# EasyEDA Pro project ProPrj_嵌赛国赛_2025-08-15.epro, schematic Schematic5
Board Name: 4G模块分线板; Create Date: 2025-06-17; Page Name: P1; Project Name: 嵌入式大赛; Schematic Name: Schematic5; Update Date: 2025-06-19; Company: 嘉立创EDA; Page Size: A4; Version: V1.0
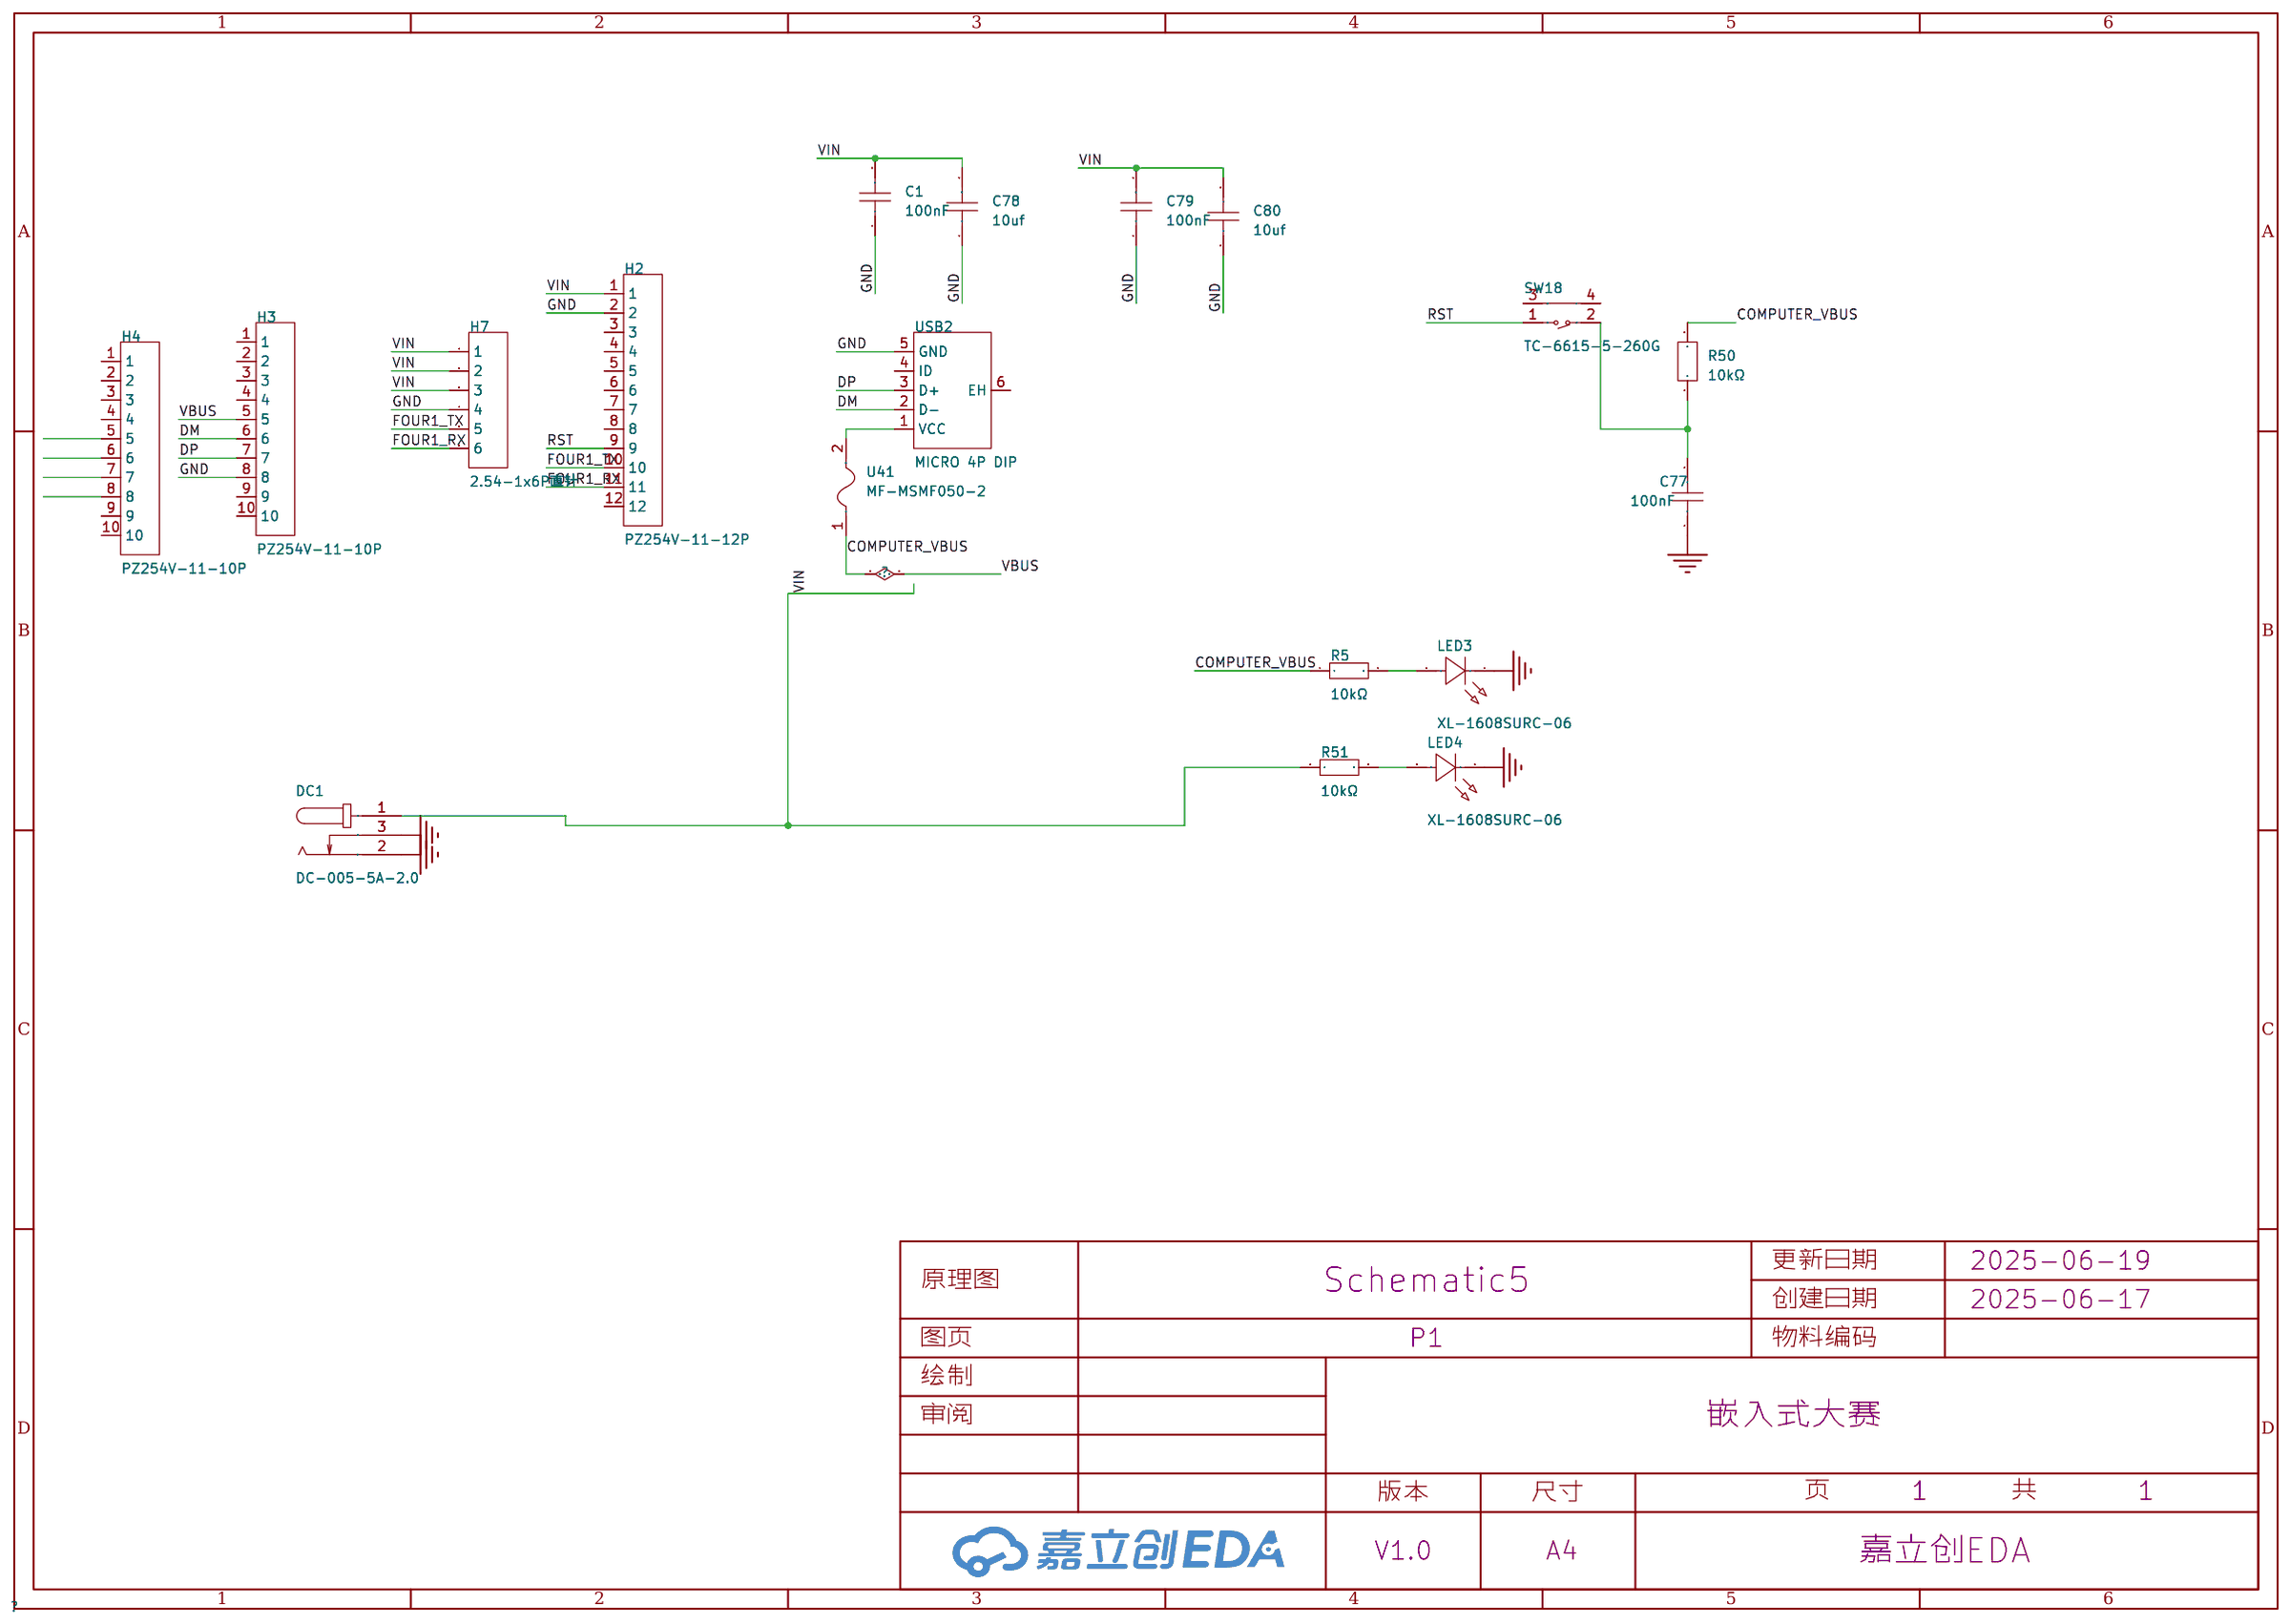
[diagram p5: schematic sheet]

## Parts
C1  100nF  [C0603]
C77  100nF  [C0603]
C78  10uf  [C0603]
C79  100nF  [C0603]
C80  10uf  [C0603]
DC1  DC-005-5A-2.0  [DC-IN-TH_DC-005-5A-2.0]
H2  PZ254V-11-12P  [HDR-TH_12P-P2.54-V-M]
H3  PZ254V-11-10P  [HDR-TH_10P-P2.54-V-M]
H4  PZ254V-11-10P  [HDR-TH_10P-P2.54-V-M]
H7  2.54-1x6P直针  [HDR-TH_6P-P2.54-V-M-1]
LED3  XL-1608SURC-06  [LED0603-RD_RED]
LED4  XL-1608SURC-06  [LED0603-RD_RED]
R5  10kΩ  [R0603]
R50  10kΩ  [R0603]
R51  10kΩ  [R0603]
SW18  TC-6615-5-260G  [SW-TH_4P-L7.5-W5.0-P4.50]
U41  MF-MSMF050-2  [F1812]
USB2  MICRO 4P DIP  [MINI-USB-SMD_MICRO-4P-DIP]

## Library data of the parts
C1 C78-C80 = CGA0603X7R104K500JT: 容值:100nF;精度:±10%;额定电压:50V;材质(温度系数):X7R;; LCSC Part Name: 100nF ±10% 50V; Supplier Part: C6119867; Manufacturer: HRE(芯声); Supplier Footprint: 0603; JLCPCB Part Class: 扩展库; Supplier: LCSC; Tolerance: ±10%; Voltage Rated: 50V; Temperature Coefficient: X7R
C77 = CC0603KRX7R9BB104: 容值:100nF;精度:±10%;额定电压:50V;材质(温度系数):X7R;; LCSC Part Name: 100nF ±10% 50V; Supplier Part: C14663; Manufacturer: YAGEO(国巨); Supplier Footprint: 0603; JLCPCB Part Class: Basic Part; Datasheet: https://atta.szlcsc.com/upload/public/pdf/source/20180910/C282072_33301C7F631E79921B82A8DAC6BCC5B3.pdf; Supplier: LCSC; Tolerance: ±10%; Voltage Rated: 50V; Temperature Coefficient: X7R
DC1 = DC-005-5A-2.0: 连接器类型:DC电源插座;安装方式:弯插;触点内径:2mm;触点外径:6.2mm;额定电流:5A;额定电压:24V;工作温度范围:-20℃~+70℃;; LCSC Part Name: DC电源插座 内径:2mm 外径:6.2mm; Supplier Part: C381116; Manufacturer: XKB Connection(中国星坤); Supplier Footprint: 插件; JLCPCB Part Class: 扩展库; Datasheet: https://atta.szlcsc.com/upload/public/pdf/source/20211015/707A35F7AB6E89C57AAB641950105BB7.pdf; Supplier: LCSC; Connector Type: DC电源插座; Mounting Style: 弯插; Inside Contact Diameter: 2mm; Outside Contact Diameter: 6.2mm; Current Rating (Max): 5A; Voltage Rating (Max): 24V; Operating Temperature Range: -20℃~+70℃
H2 = PZ254V-11-12P: 插针结构:1x12P;间距:2.54mm;行距:-;圆针/方针:方针;安装方式:直插;排数:单排;总PIN位数:12P;额定电流:3A;额定电压:250V;配合针长度:6mm;塑高:2.5mm;端接针长度:3mm;触头材质:-;工作温度:-40℃~+105℃;颜色:黑色;; LCSC Part Name: 1x12P 间距:2.54mm 方针 直插; Supplier Part: C2840012; Manufacturer: XFCN(兴飞); Supplier Footprint: 插件,P=2.54mm; JLCPCB Part Class: 扩展库; Datasheet: https://atta.szlcsc.com/upload/public/pdf/source/20200309/C492403_F9F19131791D08044AD4F84F8E751A34.pdf; Supplier: LCSC; Pin Structure: 1x12P; Pitch: 2.54mm; Circluar Pins/Square Pins: 方针; Mounting Type: 直插; Number of Rows: 单排; Number of Pins: 12P; Current Rating: 3A; Voltage Rating (Max): 250V; Length of Mating Pin: 6mm; Insulation Height: 2.5mm; Length of End Connection Pin: 3mm; Operating Temperature: -40℃~+105℃; Color: 黑色
H3 H4 = PZ254V-11-10P: 插针结构:1x10P;间距:2.54mm;行距:-;圆针/方针:方针;安装方式:直插;排数:单排;总PIN位数:10P;额定电流:-;额定电压:-;配合针长度:6mm;塑高:2.5mm;端接针长度:3mm;触头材质:黄铜;触头镀层:-;工作温度:-40℃~+105℃;颜色:黑色;; LCSC Part Name: 1x10P 间距:2.54mm 方针 直插; Supplier Part: C492409; Manufacturer: XFCN(兴飞); Supplier Footprint: 插件,P=2.54mm; JLCPCB Part Class: 扩展库; Datasheet: https://atta.szlcsc.com/upload/public/pdf/source/20200309/C492409_129C9431BDD62EBBBD0A643B6AAB9FBD.pdf; Supplier: LCSC; Pin Structure: 1x10P; Pitch: 2.54mm; Circluar Pins/Square Pins: 方针; Mounting Type: 直插; Number of Rows: 单排; Number of Pins: 10P; Length of Mating Pin: 6mm; Insulation Height: 2.5mm; Length of End Connection Pin: 3mm; Contact Material: 黄铜; Operating Temperature: -40℃~+105℃; Color: 黑色
H7 = 2.54-1x6P直针: 插针结构:1x6P;间距:2.54mm;行距:-;圆针/方针:方针;安装方式:直插;排数:单排;总PIN位数:6P;额定电流:3A;额定电压:-;配合针长度:-;塑高:-;触头材质:黄铜;触头镀层:-;工作温度:-40℃~+105℃;颜色:黑色;; LCSC Part Name: 1x6P 间距:2.54mm 方针 直插; Supplier Part: C37208; Manufacturer: BOOMELE(博穆精密); Supplier Footprint: 插件,P=2.54mm; JLCPCB Part Class: 扩展库; Datasheet: https://atta.szlcsc.com/upload/public/pdf/source/20250115/42A019761A40C8B839643401D8CA5A96.pdf; Supplier: LCSC; Pin Structure: 1x6P; Pitch: 2.54mm; Circluar Pins/Square Pins: 方针; Mounting Type: 直插; Number of Rows: 单排; Number of Pins: 6P; Current Rating: 3A; Contact Material: 黄铜; Operating Temperature: -40℃~+105℃; Color: 黑色
LED3 LED4 = XL-1608SURC-06: 发光颜色:红色;功率:55mW;正向电流:25mA;主波长:617nm~621nm;透镜颜色:无色透明透镜;色温:-;发光角度:120°;载带方式:正贴;工作温度:-30℃~+85℃;; Supplier Part: C965799; Manufacturer: XINGLIGHT(成兴光); Supplier Footprint: 0603; JLCPCB Part Class: 扩展库; Datasheet: https://atta.szlcsc.com/upload/public/pdf/source/20221102/D860AFDD1CDB02C5A8064103A32707E2.pdf; Supplier: LCSC; Emitted Color: 红色; Power Dissipation: 55mW; Forward Current: 25mA; Dominant Wavelength: 617nm~621nm; Peak Wavelength: 623nm; Lens Color: 无色透明透镜; Viewing Angle: 120°; Mounting Sytle: 正贴; Operating Temperature: -30℃~+85℃
R5 R51 = 0603WAF1002T5E: 电阻类型:厚膜电阻;阻值:10kΩ;精度:±1%;功率:100mW;最大工作电压:75V;温度系数:±100ppm/℃;; LCSC Part Name: 厚膜电阻 10kΩ ±1% 100mW; Supplier Part: C25804; Manufacturer: UNI-ROYAL(厚声); Supplier Footprint: 0603; JLCPCB Part Class: Basic Part; Datasheet: https://atta.szlcsc.com/upload/public/pdf/source/20200306/C422600_1E6D84923E4A46A82E41ADD87F860B5C.pdf; Supplier: LCSC; Type: 厚膜电阻; Tolerance: ±1%; Power(Watts): 100mW; Overload Voltage (Max): 75V; Temperature Coefficient: ±100ppm/℃; Operating Temperature Range: -55℃~+155℃
R50 = FRC0603J103TS: 电阻类型:厚膜电阻;阻值:10kΩ;精度:±5%;功率:100mW;最大工作电压:75V;温度系数:±100ppm/℃;; LCSC Part Name: 10kΩ ±5% 100mW 厚膜电阻; Supplier Part: C2930027; Manufacturer: FOJAN(富捷); Supplier Footprint: 0603; JLCPCB Part Class: 扩展库; Datasheet: https://atta.szlcsc.com/upload/public/pdf/source/20211221/925EC7D7225764EE0046F22065062C87.pdf; Supplier: LCSC; Type: 厚膜电阻; Tolerance: ±5%; Power(Watts): 100mW; Overload Voltage (Max): 75V; Temperature Coefficient: ±100ppm/℃; Operating Temperature Range: -55℃~+155℃
SW18 = TC-6615-5-260G: 电路结构:单刀单掷;按钮形状:-;作用力:260gf;安装方式:卧插;开关长度:6mm;开关宽度:6mm;开关高度:5mm;带支架:带支架;触点电流:50mA;额定电压(AC):-;额定电压(DC):12V;额定功率:-;绝缘电阻:-;带灯:-;机械寿命:-;; LCSC Part Name: 轻触6*6*5支架 插件260g; Supplier Part: C2845270; Manufacturer: HCTL(华灿天禄); Supplier Footprint: 插件; JLCPCB Part Class: 扩展库; Datasheet: https://atta.szlcsc.com/upload/public/pdf/source/20230523/3B07ECEFF69432C539FEAF1B55455C52.pdf; Supplier: LCSC; Circuit: 单刀单掷; Operating Force: 260gf; Mounting Style: 卧插; Switch Length: 6mm; Switch Width: 6mm; Switch Height: 5mm; Strike Gundam: 带支架; Contact Current: 50mA; Voltage Rating (DC): 12V
U41 = MF-MSMF050-2: 耐压:15V;最大电流:100A;保持电流(Ih):500mA;跳闸电流:1A;; LCSC Part Name: 15V 500mA 1812自恢复; Supplier Part: C17313; Manufacturer: BOURNS; Supplier Footprint: 1812; JLCPCB Part Class: 扩展库; Datasheet: https://atta.szlcsc.com/upload/public/pdf/source/20161125/1480068354310.pdf; Supplier: LCSC; Voltage - Max: 15V; Current - Max: 100A; Hold Current: 500mA; Trip Current: 1A; Resistance - Initial (Ri) (Min): 150mΩ; Resistance - Post Trip (R1) (Max): 1Ω; Time to Trip(Max): 150ms; Operating Temperature: -40℃~+85℃
USB2 = MICRO 4P DIP: 连接器类型:Micro-B;标准:USB 2.0;公母:母;安装方式:卧贴;触点数量:5P;端口数量:1;额定电流 - 电源:1A;工作温度范围:-30℃~+80℃;; LCSC Part Name: Micro-B 母 卧贴; Supplier Part: C456008; Manufacturer: SHOU HAN(首韩); Supplier Footprint: SMD; JLCPCB Part Class: Extended Part; Datasheet: https://atta.szlcsc.com/upload/public/pdf/source/20191113/C456008_715AB785ACAEB21AD2CB341B96491593.pdf; Supplier: LCSC; Connector Type: Micro-B; Standard: USB 2.0; Gender: 母; Mounting Style: 卧贴; Number of Contacts: 5P; Number of Ports: 1; Current Rating - Power (Max): 1A; Operating Temperature Range: -30℃~+80℃; Core Colour: 黑色

## Nets
GND: C1.1 C77.1 C78.1 C79.1 C80.1 DC1.2 DC1.3 H2.2 H3.8 H7.4 LED3.1(K) LED4.1(K) USB2.5(GND)
VIN: C1.2 C78.2 C79.2 C80.2 DC1.1 H2.1 H7.1 H7.2 H7.3 R51.1
COMPUTER_VBUS: H3.5 R5.1 R50.2 U41.1
DM: H3.6 USB2.2(D-)
DP: H3.7 USB2.3(D+)
FOUR1_RX: H2.11 H7.6
FOUR1_TX: H2.10 H7.5
RST: H2.9 SW18.1
$1N802: U41.2 USB2.1(VCC)
$1N1239: C77.2 R50.1 SW18.2
$1N2955: LED3.2(A) R5.2
$1N3053: LED4.2(A) R51.2

Not connected (* = marked no-connect by the designer): H2 3 4 5 6 7 8 12; H3 1 2 3 4 9 10; H4 1 2 3 4 5 6 7 8 9 10; SW18 3 4; USB2 4(ID) 6(EH)
